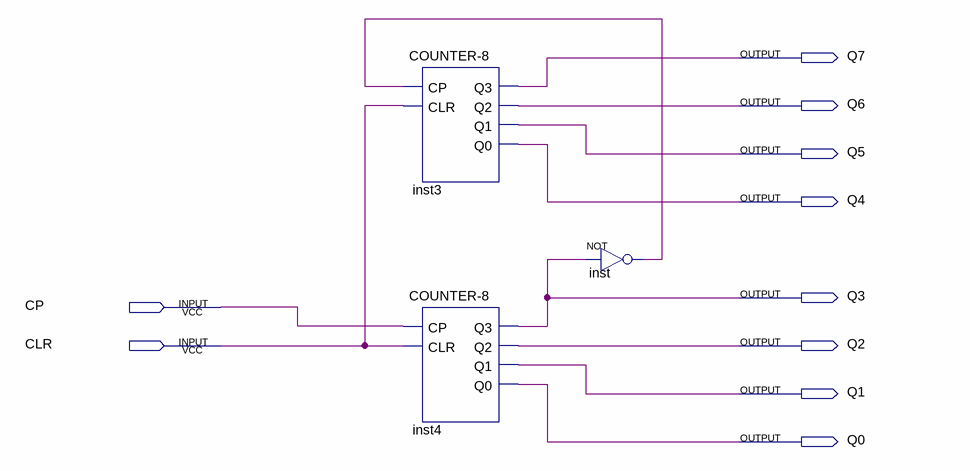
[diagram p0: schematic sheet]
// Quartus schematic counter-256.bdf as structural Verilog: 3 symbols, 10 pins
module \counter-256  (
  input  CP,
  input  CLR,
  output Q7,
  output Q6,
  output Q5,
  output Q4,
  output Q3,
  output Q2,
  output Q1,
  output Q0
);

  wire inst_out;

  \COUNTER-8  inst3 (.CP(inst_out), .CLR(CLR), .Q3(Q7), .Q2(Q6), .Q1(Q5), .Q0(Q4));
  \COUNTER-8  inst4 (.CP(CP), .CLR(CLR), .Q3(Q3), .Q2(Q2), .Q1(Q1), .Q0(Q0));
  not inst (inst_out, Q3);
endmodule
